# Altium schematic sheet Sheet2.SchDoc
size A; SheetNumber: 2; SheetTotal: 3
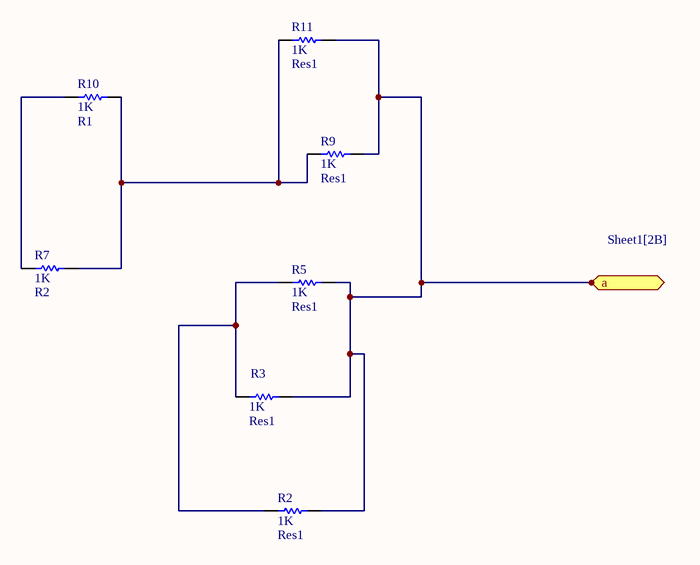
[diagram p0: Sheet2.SchDoc]

## Parts
R2  Res1  value 1K  [AXIAL-0.3]
R3  Res1  value 1K  [AXIAL-0.3]
R5  Res1  value 1K  [AXIAL-0.3]
R7  R2  value 1K  [AXIAL-0.3]
R9  Res1  value 1K  [AXIAL-0.3]
R10  R1  value 1K  [AXIAL-0.3]
R11  Res1  value 1K  [AXIAL-0.3]

## Ports
a (bidir, see Sheet1[2B])

## Nets
a: R2.2 R3.2 R5.2 R9.2 R11.2 ; port a
NetR2_1: R2.1 R3.1 R5.1
NetR7_1: R7.1 R10.1
NetR7_2: R7.2 R9.1 R10.2 R11.1

## Library data of the parts
R2 R3 R5 R7 R9-R11 = Res1: Resistor; Published: 8-Jun-2000; LatestRevisionDate: 17-Jul-2002; LatestRevisionNote: Re-released for DXP Platform.; PackageReference: AXIAL-0.3; Publisher: Altium Limited; PackageDescription: Axial Device, Thru-Hole; 2 Leads; 0.3 in Pin Spacing